# EAGLE design moids2_0.1power (EAGLE 5.11)
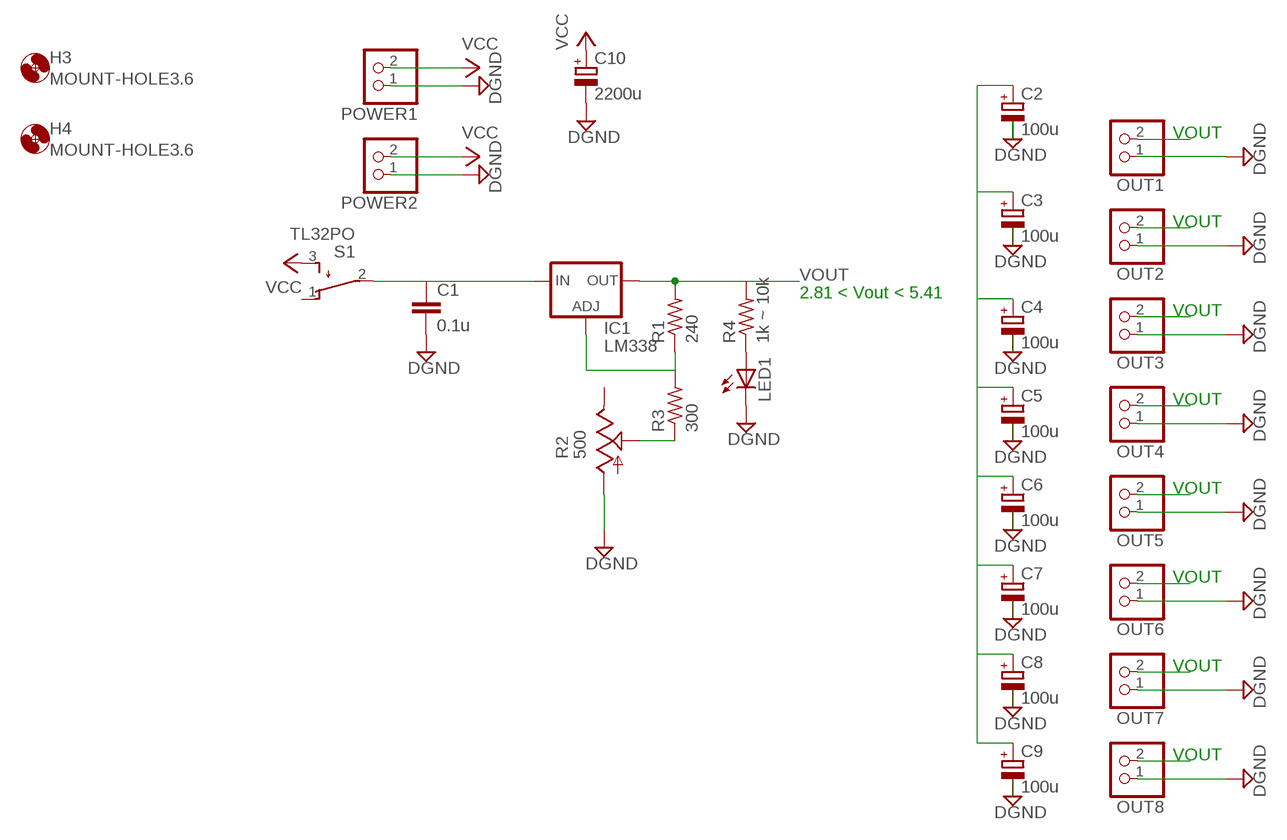
[diagram p0: schematic, sheet 1]

## Parts
C1  0.1u  C-EU025-024X044  [C025-024X044]
C2  100u  CPOL-EUE2.5-5  [E2,5-5]
C3  100u  CPOL-EUE2.5-5  [E2,5-5]
C4  100u  CPOL-EUE2.5-5  [E2,5-5]
C5  100u  CPOL-EUE2.5-5  [E2,5-5]
C6  100u  CPOL-EUE2.5-5  [E2,5-5]
C7  100u  CPOL-EUE2.5-5  [E2,5-5]
C8  100u  CPOL-EUE2.5-5  [E2,5-5]
C9  100u  CPOL-EUE2.5-5  [E2,5-5]
C10  2200u  CPOL-EUE5-10.5  [E5-10,5]
H3  MOUNT-HOLE3.6  [3,6]
H4  MOUNT-HOLE3.6  [3,6]
IC1  LM338  LM317TS  [317TS]
LED1  LED3MM  [LED3MM]
OUT1  PINHD-1X2  [1X02]
OUT2  PINHD-1X2  [1X02]
OUT3  PINHD-1X2  [1X02]
OUT4  PINHD-1X2  [1X02]
OUT5  PINHD-1X2  [1X02]
OUT6  PINHD-1X2  [1X02]
OUT7  PINHD-1X2  [1X02]
OUT8  PINHD-1X2  [1X02]
POWER1  PINHD-1X2  [1X02]
POWER2  PINHD-1X2  [1X02]
R1  240  R-US_0207/2V  [0207/2V]
R2  500  TRIM_US-B25P  [B25P]
R3  300  R-US_0207/2V  [0207/2V]
R4  1k ~ 10k  R-US_0207/2V  [0207/2V]
S1  TL32PO  [TL3XPO]

## Nets
DGND: C1.2 C2.- C3.- C4.- C5.- C6.- C7.- C8.- C9.- C10.- LED1.K(C) OUT1.1 OUT2.1 OUT3.1 OUT4.1 OUT5.1 OUT6.1 OUT7.1 OUT8.1 POWER1.1 POWER2.1 R2.A
N$3: R2.S R3.1
N$4: IC1.1(ADJ) R1.1 R3.2
N$6: LED1.A R4.1
VCC: C10.+ POWER1.2 POWER2.2 S1.3(S)
VIN: C1.1 IC1.3(IN) S1.2(P)
VOUT: C2.+ C3.+ C4.+ C5.+ C6.+ C7.+ C8.+ C9.+ IC1.2(OUT) OUT1.2 OUT2.2 OUT3.2 OUT4.2 OUT5.2 OUT6.2 OUT7.2 OUT8.2 R1.2 R4.2
Unconnected: R2.E S1.1(O)

## Notes on the sheet
- VOUT
- VOUT
- 2.81 < Vout < 5.41
- VOUT
- VOUT
- VOUT
- VOUT
- VOUT
- VOUT

## Library data of the parts
C1 = rcl:C-EU: CAPACITOR, European symbol
C2-C10 = rcl:CPOL-EU: POLARIZED CAPACITOR, European symbol
H3 H4 = holes:MOUNT-HOLE: MOUNTING HOLE with drill center marker
IC1 = v-reg:LM317TS: VOLTAGE REGULATOR
LED1 = led:LED: LED OSRAM: - CHIPLED LG R971, LG N971, LY N971, LG Q971, LY Q971, LO R971, LY R971 LH N974, LH R974 LS Q976, LO Q976, LY Q976 LO Q996 - Hyper CHIPLED LW Q18S LB Q993, LB Q99A, LB R99A - SideLED LS A670, LO A670, LY A670, LG A670, LP A670 LB A673, LV A673, LT A673, LW A673 LH A674 LY A675 LS A676, LA A676, LO A676, LY A676, LW A676 LS A679, LY A679, LG A679 - Hyper Micro SIDELED® LS Y876, LA Y876, LO Y876, LY Y876 LT Y87S - SmartLED LW L88C, LW L88S LB L89C, LB L89S, LG L890 LS L89K, LO L89K, LY L89K LS L896, LA L896, LO L896, LY L896 - TOPLED LS T670, LO T670, LY T670, LG T670, LP T670 LSG T670, LSP T670, LSY T670, LOP T670, LYG T670 LG T671, LOG T671, LSG T671 LB T673, LV T673, LT T673, LW T673 LH T674 LS T676, LA T676, LO T676, LY T676, LB T676, LH T676, LSB T676, LW T676 LB T67C, LV T67C, LT T67C, LS T67K, LO T67K, LY T67K, LW E67C LS E67B, LA E67B, LO E67B, LY E67B, LB E67C, LV E67C, LT E67C LW T67C LS T679, LY T679, LG T679 LS T770, LO T770, LY T770, LG T770, LP T770 LB T773, LV T773, LT T773, LW T773 LH T774 LS E675, LA E675, LY E675, LS T675 LS T776, LA T776, LO T776, LY T776, LB T776 LHGB T686 LT T68C, LB T68C - Hyper Mini TOPLED® LB M676 - Mini TOPLED Santana® LG M470 LS M47K, LO M47K, LY M47K Source: http://www.osram.convergy.de LUXEON: - LUMILED® LXK2-PW12-R00, LXK2-PW12-S00, LXK2-PW14-U00, LXK2-PW14-V00 LXK2-PM12-R00, LXK2-PM12-S00, LXK2-PM14-U00 LXK2-PE12-Q00, LXK2-PE12-R00, LXK2-PE12-S00, LXK2-PE14-T00, LXK2-PE14-U00 LXK2-PB12-K00, LXK2-PB12-L00, LXK2-PB12-M00, LXK2-PB14-N00, LXK2-PB14-P00, LXK2-PB14-Q00 LXK2-PR12-L00, LXK2-PR12-M00, LXK2-PR14-Q00, LXK2-PR14-R00 LXK2-PD12-Q00, LXK2-PD12-R00, LXK2-PD12-S00 LXK2-PH12-R00, LXK2-PH12-S00 LXK2-PL12-P00, LXK2-PL12-Q00, LXK2-PL12-R00 Source: www.luxeon.com KINGBRIGHT: KA-3528ASYC Source: www.kingbright.com
OUT1-OUT8 POWER1 POWER2 = pinhead:PINHD-1X2: PIN HEADER
R1 R3 R4 = rcl:R-US_: RESISTOR, American symbol
R2 = pot:TRIM_US-: POTENTIOMETER
S1 = switch:TL32PO: TINY SWITCH ON - MOM Source: http://www2.produktinfo.conrad.com/datenblaetter/700000-724999/705152-da-01-de-Subminiaturschalter_TL_36YO.pdf

## Board
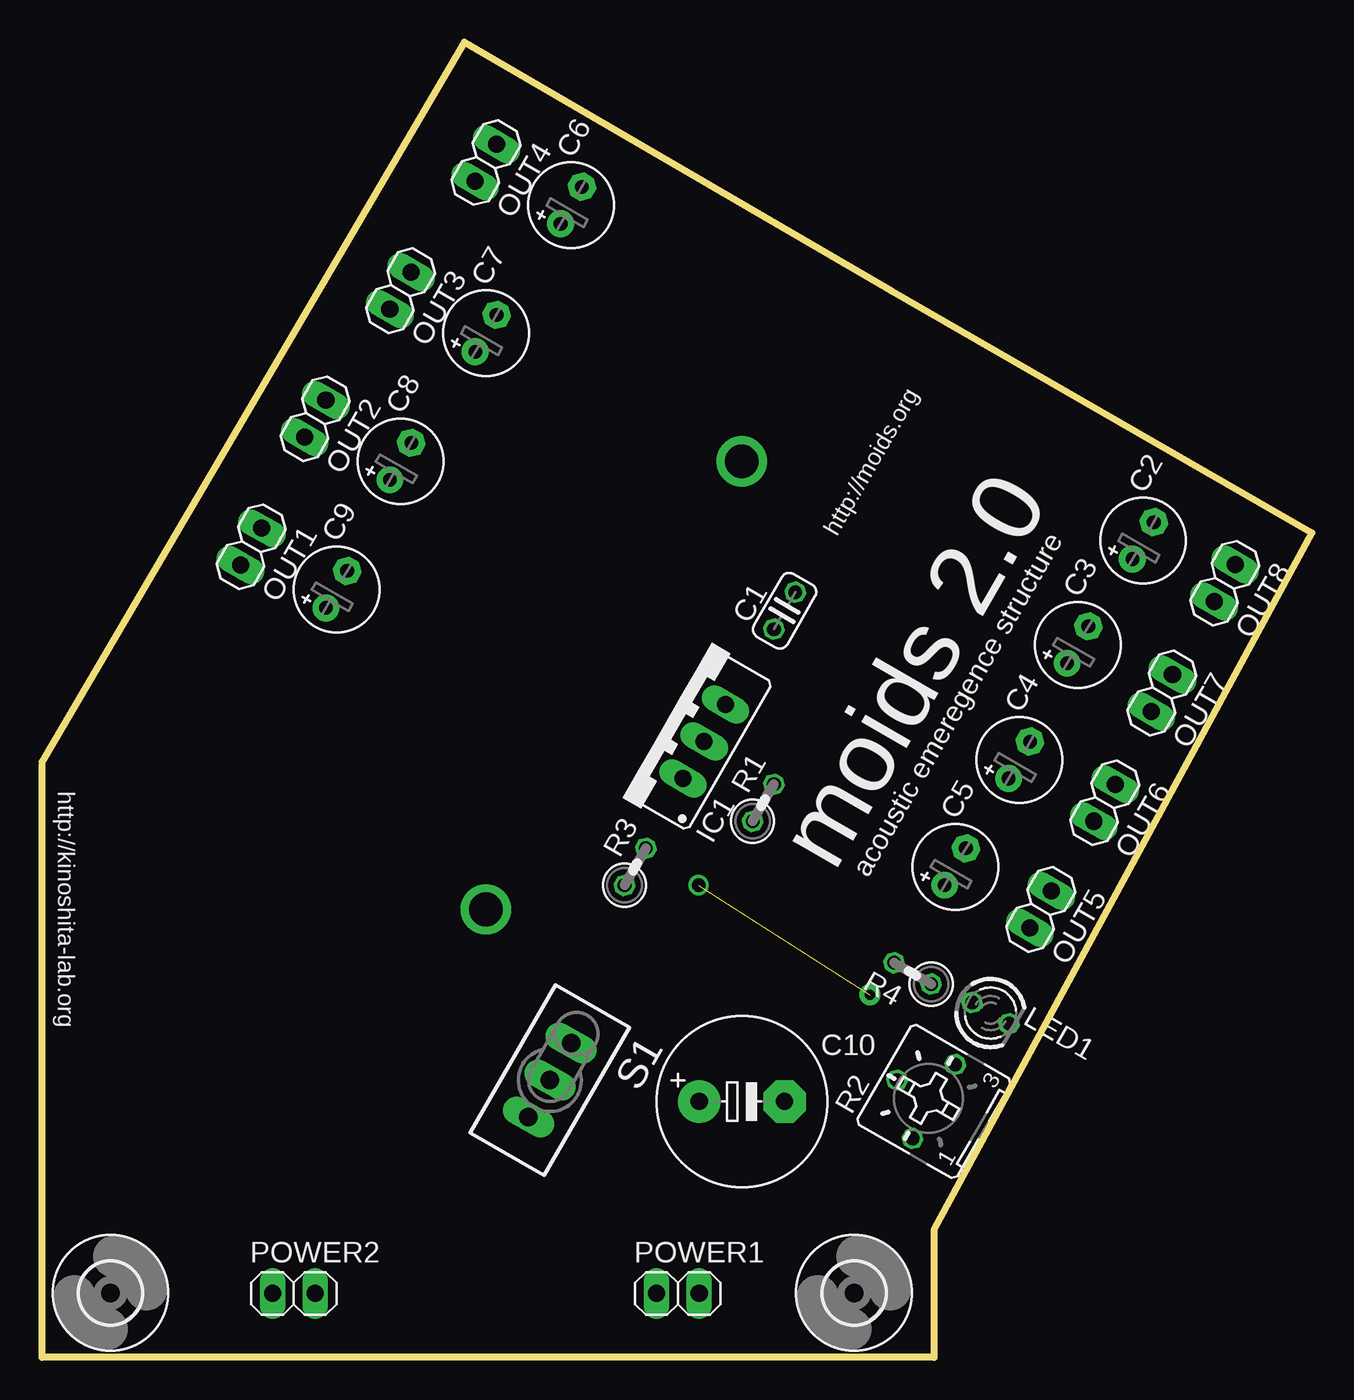
[diagram p1: board, top side]
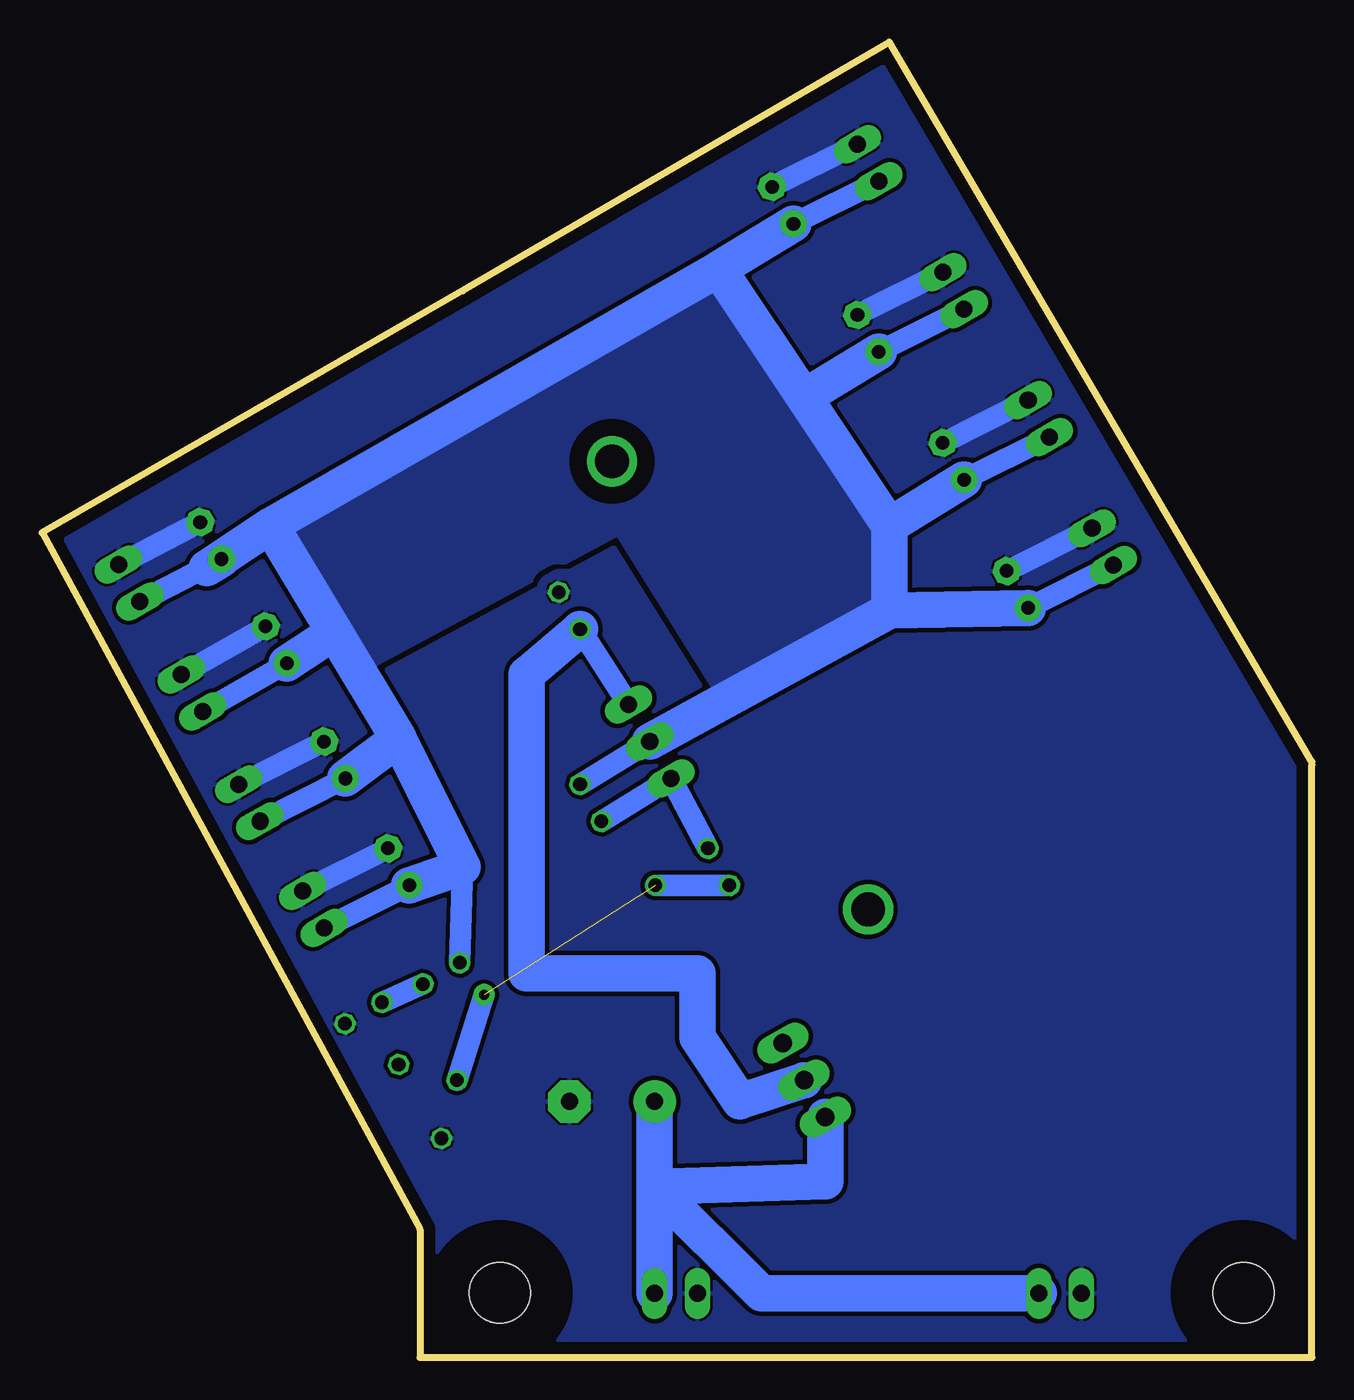
[diagram p2: board, bottom side, seen from below]

Size 75.59 x 78.3 mm. Coordinates in mm from the lower left corner, seen from the top.
Outline: 0,35.27 0,0 53.09,0 53.09,7.62 75.59,49.09 50.55,63.5 25.15,78.3 0.01,35.45
Copper layers (1*16): Top 0.035mm / dielectric 1.5mm / Bottom 0.035mm
Design rules "p-ban_min": minimum track width 0.15mm, minimum drill 0.3mm, track to track 0.15mm, track to pad 0.15mm, pad to pad 0.15mm, via to via 0.15mm, smd to smd 0.15mm, copper to edge 0.7mm, drill to drill 0.45mm, minimum pad ring 0.15mm, minimum via ring 0.15mm, stop-mask expansion 4mil, vias tented up to drill 0mil, thermal gap 0.15mm

### Footprints (pad centres in the part's own frame; a part is rotated, then mirrored left to right if it is on the bottom)
C025-024X044 = drill 0.813 octagon: 1 -1.27,0; 2 1.27,0
E2,5-5 = drill 0.813 pad 1.6 round: + -1.27,0 | drill 0.813 pad 1.6 octagon: - 1.27,0
E5-10,5 = drill 1.016 pad 2.54 round: + -2.54,0 | drill 1.016 pad 2.54 octagon: - 2.54,0
3,6 = hole 3.6: 0,0
317TS = drill 1.016 long: 1 -2.54,-2.54; 2 0,-2.54; 3 2.54,-2.54
LED3MM = drill 0.813 octagon: A -1.27,0; K 1.27,0
1X02 = drill 1.016 long: 1 -1.27,0; 2 1.27,0
0207/2V = drill 0.813 octagon: 1 -1.27,0; 2 1.27,0
B25P = drill 0.813 octagon: A -2.54,0; E 2.54,0; S 0,2.54
TL3XPO = drill 1.1 pad 1.422 long: 1 -2.54,0; 2 0,0; 3 2.54,0

### Placement (x,y rotation side)
C1  44.2,44.45 60 top
C2  65.54,48.62 60 top
C3  61.65,42.42 60 top
C4  58.17,35.56 60 top
C5  54.36,29.21 60 top
C6  31.5,68.58 60 top
C7  26.42,60.96 60 top
C8  21.34,53.34 60 top
C9  17.53,45.72 60 top
C10  41.66,15.24 0 top
H3  48.34,3.85 0 top
H4  4.08,3.85 0 top
IC1  37.22,37.93 60 top
LED1  56.46,20.5 330 top
OUT1  12.45,48.26 240 top
OUT2  16.26,55.88 240 top
OUT3  21.34,63.5 240 top
OUT4  26.42,71.12 240 top
OUT5  59.44,26.67 240 top
OUT6  63.25,33.02 240 top
OUT7  66.66,39.55 240 top
OUT8  70.4,46.09 240 top
POWER1  37.85,3.81 0 top
POWER2  14.99,3.81 0 top
R1  42.93,33.02 60 top
R2  53.09,15.24 60 top
R3  35.31,29.21 60 top
R4  51.82,22.86 150 top
S1  30.23,16.51 240 top

### Tracks (layer width: path | path; a pad name or v marks a point on that pad's centre or on a via)
DGND
  Bottom 1.27: OUT4.1 C6.- | OUT3.1 C7.- | OUT2.1 C8.- | OUT1.1 C9.- | C5.- OUT5.1 | C4.- OUT6.1 | C3.- OUT7.1 | C2.- OUT8.1
  pour Bottom (isolate 0.254, rank 6): 0.36,35.19 25.37,77.67 75.27,48.89 52.74,7.8 52.66,0.39 0.43,0.39
N$1  (via drill 2)
  other vias: 41.66,53.34
N$2  (via drill 2)
  other vias: 26.42,26.67
N$3  (via drill 0.6 pad 1.27, 0.8 pad 1.02)  (1 unrouted)
  Bottom 1.27: R2.S v49.28,21.59 | R3.1 v39.08,28.11 | v39.08,28.11
N$4
  Bottom 1.27: R1.1 IC1.1 R3.2
N$6
  Bottom 1.27: R4.1 LED1.A
VCC
  Bottom 2.184: 39.12,10.16 POWER1.2 | POWER2.2 32.77,3.81 39.12,10.16 | 39.12,10.16 C10.+ | 39.12,10.16 28.96,10.5 S1.3
VIN
  Bottom 1.27: C1.1 IC1.3
  Bottom 2.184: S1.2 34.04,15.24 36.58,19.05 36.58,22.86 46.74,22.86 46.74,40.64 C1.1
VOUT
  Bottom 1.27: C6.+ OUT4.2 | C7.+ OUT3.2 | C8.+ OUT2.2 | OUT1.2 C9.+ | C5.+ OUT5.2 | C4.+ OUT6.2 | C3.+ OUT7.2 | C2.+ OUT8.2 | IC1.2 R1.2 | 50.55,29.21 R4.2
  Bottom 2.184: C9.+ 25.15,44.45 | 25.15,44.45 25.15,49.53 | 25.15,49.53 C8.+ | 25.15,49.53 30.23,57.15 | 30.23,57.15 C7.+ | 30.23,57.15 35.31,64.77 | 35.31,64.77 C6.+ | 25.15,44.45 IC1.2 | 35.31,64.77 61.98,49.53 | 61.98,49.53 65.79,46.99 C2.+ | 61.98,49.53 58.17,43.18 | 58.17,43.18 54.36,36.83 | 54.36,36.83 50.55,29.21 C5.+ | 54.36,36.83 C4.+ | 58.17,43.18 C3.+
  pour Bottom (isolate 1.016, rank 3): 35.31,64.77 25.15,49.53 25.15,44.45 55.63,53.34
  pour Bottom (isolate 1.016, rank 3): 40.39,49.53 56.9,40.64 61.98,49.53 51.82,54.61
  pour Bottom (isolate 1.016, rank 3): 41.66,49.53 35.31,39.37 25.15,44.45

### Text on the board
tPlace: http://moids.org | http://kinoshita-lab.org | moids 2.0 | acoustic emeregence structure